# EAGLE design IC555 Timer (EAGLE 9.6.2)
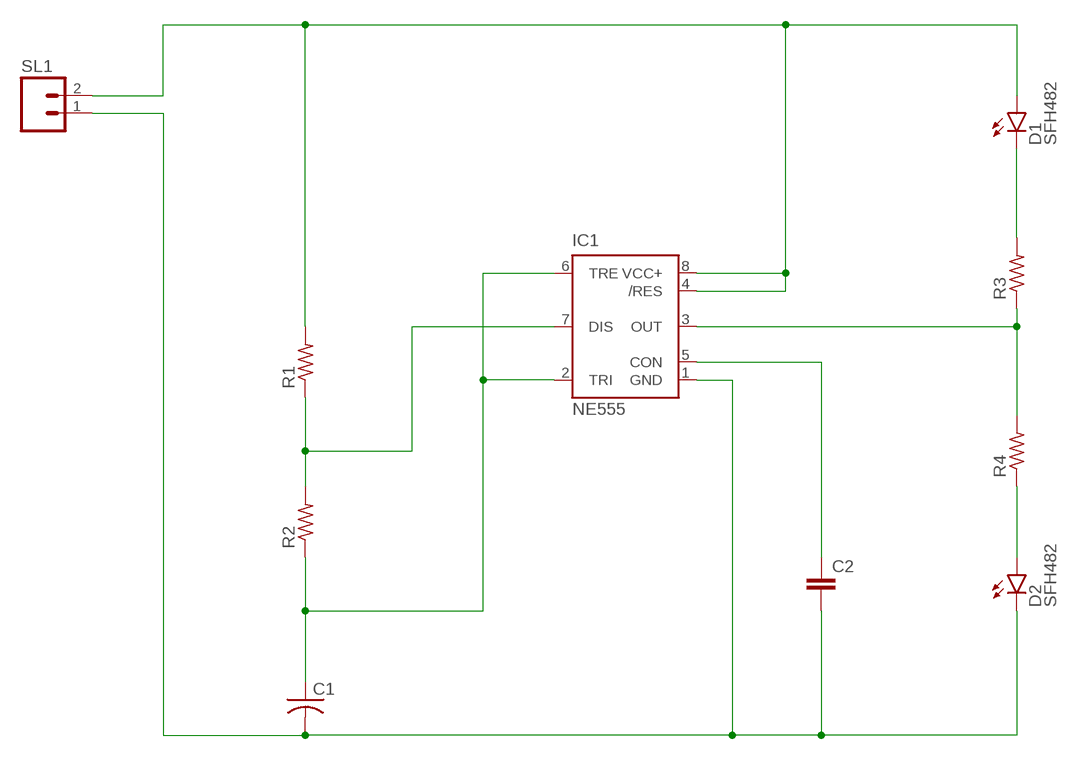
[diagram p0: schematic, sheet 1]

## Parts
C1  C-US025-030X050  [C025-030X050]
C2  C-EU025-024X044  [C025-024X044]
D1  SFH482  [SFH482]
D2  SFH482  [SFH482]
IC1  NE555  [DIL-08]
R1  R-US_0204/5  [0204/5]
R2  R-US_0204/5  [0204/5]
R3  R-US_0204/5  [0204/5]
R4  R-US_0204/5  [0204/5]
SL1  M02  [02P]

## Nets
N$1: IC1.7(DIS) R1.1 R2.2
N$2: C1.1 IC1.2(TRI) IC1.6(TRE) R2.1
N$3: D1.A IC1.4(/RES) IC1.8(VCC+) R1.2 SL1.2
N$4: C1.2 C2.2 D2.K(C) IC1.1(GND) SL1.1
N$5: D1.K(C) R3.2
N$6: IC1.3(OUT) R3.1 R4.2
N$7: D2.A R4.1
N$11: C2.1 IC1.5(CON)

## Library data of the parts
C1 = rcl:C-US: CAPACITOR, American symbol; SPICEPREFIX: C
C2 = rcl:C-EU: CAPACITOR, European symbol; SPICEPREFIX: C
D1 D2 = led:SFH482: IR LED infrared emitting diode, Infineon
IC1 = st-microelectronics:NE555: General purpose bipolar Timer; MF: Arrow Electronics; MPN: NE555N; OC_FARNELL: 1467742; OC_NEWARK: 89K1486
R1-R4 = rcl:R-US_: RESISTOR, American symbol; SPICEPREFIX: R
SL1 = con-amp-quick:M02: AMP QUICK CONNECTOR; OC_FARNELL: unknown; OC_NEWARK: unknown

## Board
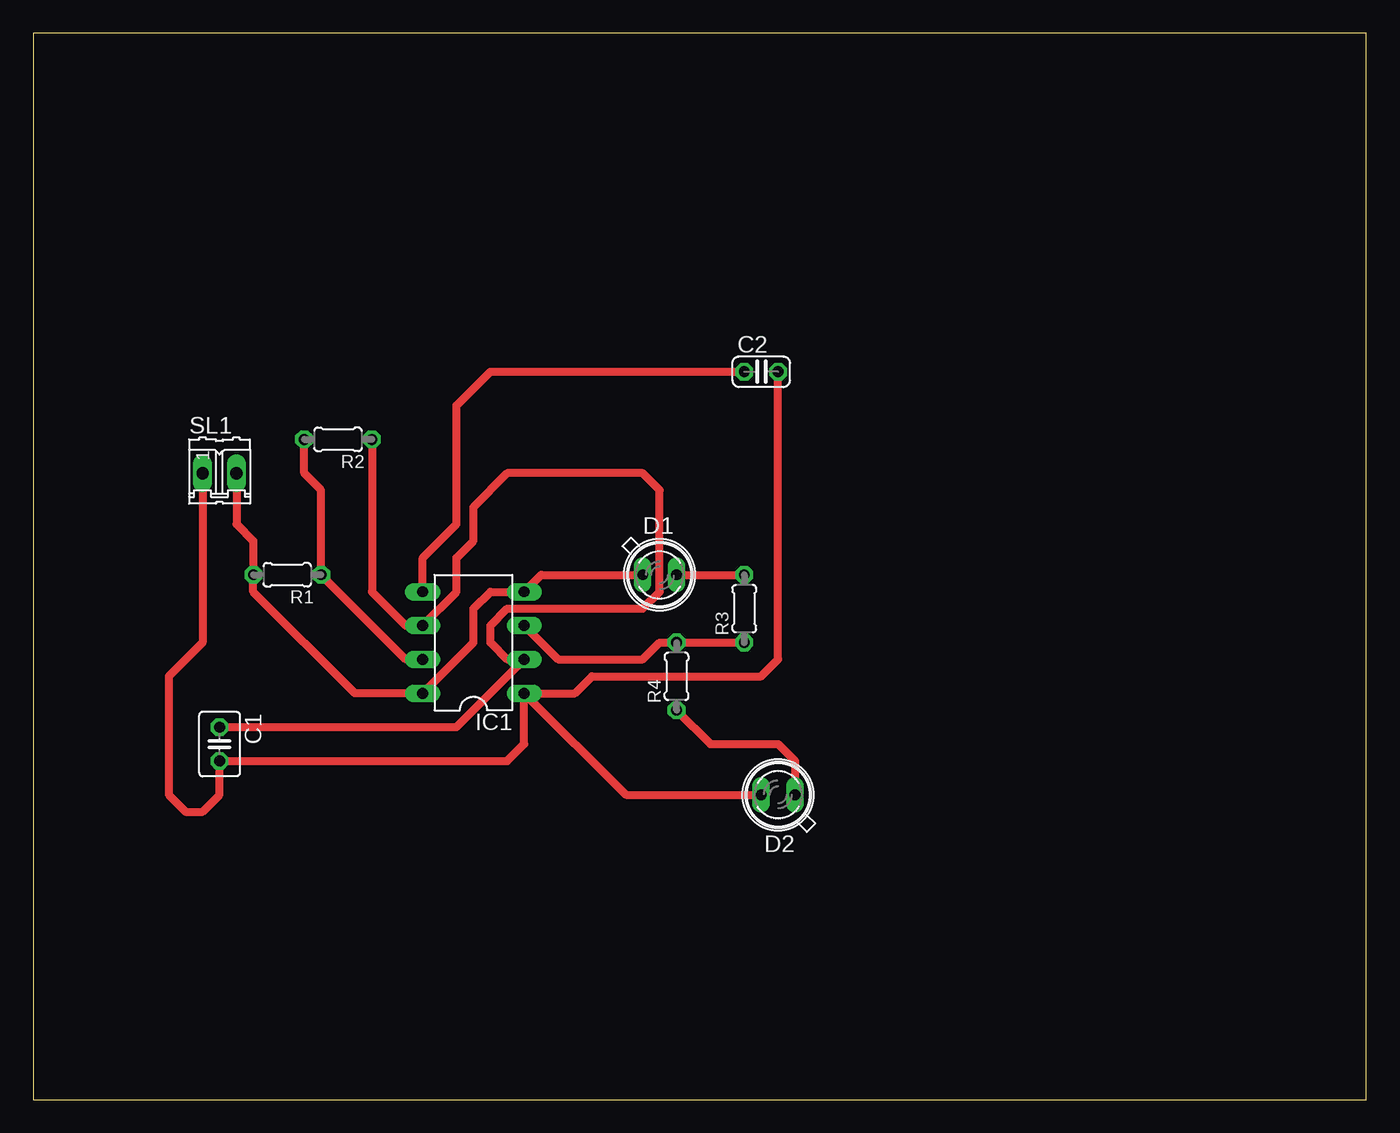
[diagram p1: board, top side]

Size 100 x 80 mm. Coordinates in mm from the lower left corner, seen from the top.
Outline: 0,0 100,0 100,80 0,80 0,0
Copper layers (1*16): Top 0.035mm / dielectric 1.5mm / Bottom 0.035mm
Design rules "default": minimum track width 6mil, minimum drill 0.35mm, track to track 6mil, track to pad 6mil, pad to pad 6mil, via to via 6mil, smd to smd 6mil, copper to edge 40mil, drill to drill 6mil, minimum pad ring 10mil, minimum via ring 8mil, stop-mask expansion 4mil, vias tented up to drill 0mil, thermal gap 10mil

### Footprints (pad centres in the part's own frame; a part is rotated, then mirrored left to right if it is on the bottom)
C025-030X050 = drill 0.813 octagon: 1 -1.27,0; 2 1.27,0
C025-024X044 = drill 0.813 octagon: 1 -1.27,0; 2 1.27,0
SFH482 = drill 0.813 long: A -1.27,0; K 1.27,0
DIL-08 = drill 0.813 long: 1 -3.81,-3.81; 2 -1.27,-3.81; 3 1.27,-3.81; 4 3.81,-3.81; 5 3.81,3.81; 6 1.27,3.81; 7 -1.27,3.81; 8 -3.81,3.81
0204/5 = drill 0.813 octagon: 1 -2.54,0; 2 2.54,0
02P = drill 0.914 long: 1 -1.27,0; 2 1.27,0

### Placement (x,y rotation side)
C1  13.97,26.67 270 top
C2  54.61,54.61 0 top
D1  46.99,39.37 0 top
D2  55.88,22.86 180 top
IC1  33.02,34.29 90 top
R1  19.05,39.37 180 top
R2  22.86,49.53 180 top
R3  53.34,36.83 90 top
R4  48.26,31.75 90 top
SL1  13.97,46.99 0 top

### Tracks (layer width: path | path; a pad name or v marks a point on that pad's centre or on a via)
N$1
  Top 0.61: R2.2 20.32,46.99 21.59,45.72 R1.1 27.94,33.02 IC1.7
N$2
  Top 0.61: R2.1 25.4,38.1 27.94,35.56 IC1.6 31.75,38.1 31.75,40.64 33.02,41.91 33.02,44.45 35.56,46.99 45.72,46.99 46.99,45.72 46.99,38.1 45.72,36.83 35.56,36.83 34.29,35.56 34.29,34.29 35.56,33.02 IC1.2 31.75,27.94 C1.1
N$3
  Top 0.61: SL1.2 15.24,43.18 16.51,41.91 R1.2 16.51,38.1 24.13,30.48 IC1.8 33.02,34.29 33.02,36.83 34.29,38.1 IC1.4 38.1,39.37 D1.A
N$4
  Top 0.61: SL1.1 12.7,34.29 10.16,31.75 10.16,22.86 11.43,21.59 12.7,21.59 13.97,22.86 C1.2 35.56,25.4 36.83,26.67 IC1.1 | IC1.1 44.45,22.86 D2.K | IC1.1 40.64,30.48 41.91,31.75 54.61,31.75 55.88,33.02 C2.2
N$5
  Top 0.61: D1.K R3.2
N$6
  Top 0.61: R3.1 R4.2 46.99,34.29 45.72,33.02 39.37,33.02 IC1.3
N$7
  Top 0.61: R4.1 50.8,26.67 55.88,26.67 57.15,25.4 D2.A
N$11
  Top 0.61: IC1.5 29.21,40.64 31.75,43.18 31.75,52.07 34.29,54.61 C2.1